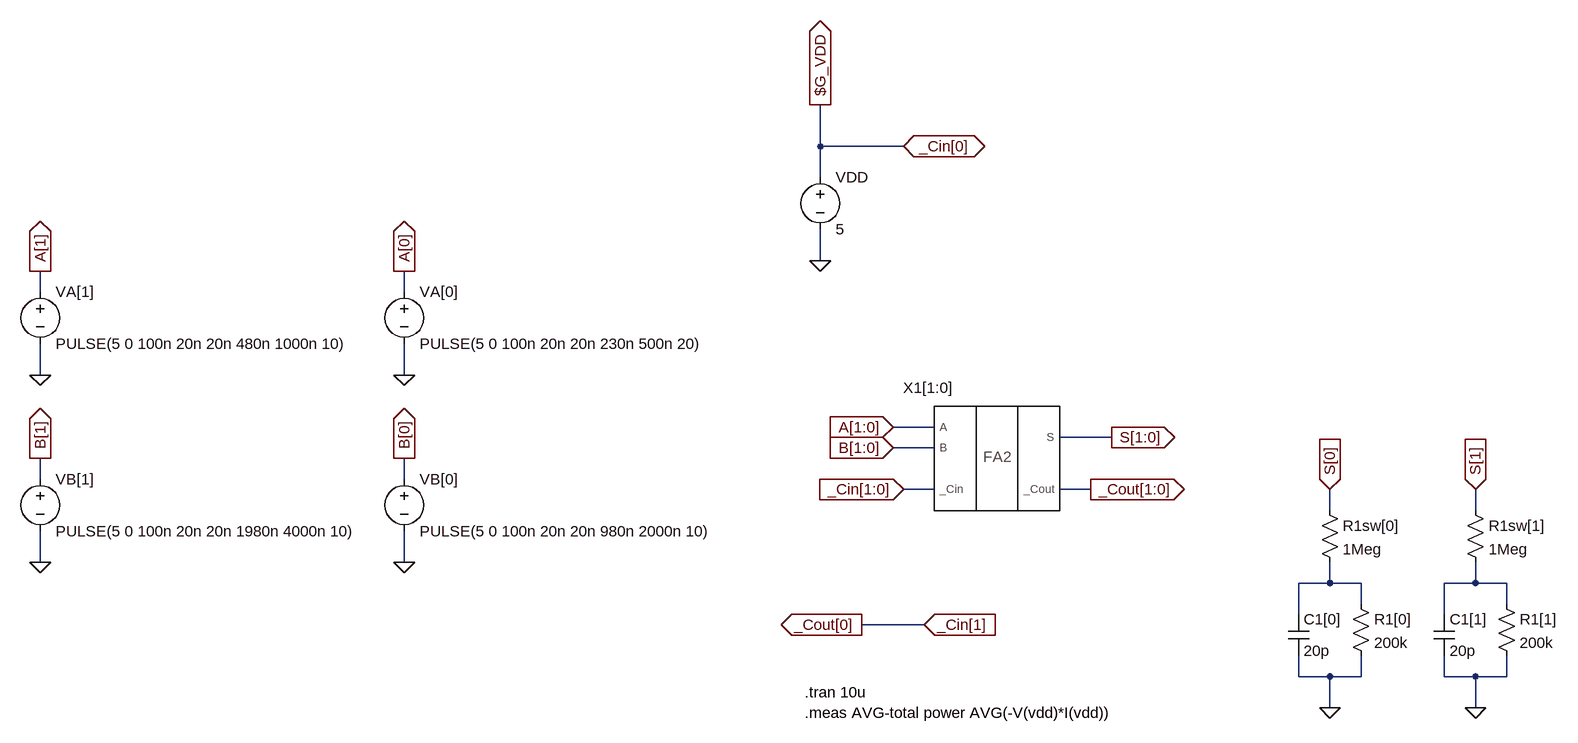
[diagram p0: schematic fa2_top[2bit].asc]
fa2_top[2bit].asc, the LTspice schematic file:
Version 4
SHEET 1 2652 1172
WIRE 0 -80 0 -144
WIRE 128 -80 0 -80
WIRE 0 -32 0 -80
WIRE 0 96 0 48
WIRE -1200 144 -1200 112
WIRE -640 144 -640 112
WIRE -1200 272 -1200 224
WIRE -640 272 -640 224
WIRE 176 352 112 352
WIRE 448 368 368 368
WIRE 176 384 112 384
WIRE -1200 432 -1200 400
WIRE -640 432 -640 400
WIRE 176 448 128 448
WIRE 416 448 368 448
WIRE 784 480 784 448
WIRE 1008 480 1008 448
WIRE -1200 560 -1200 512
WIRE -640 560 -640 512
WIRE 784 592 784 560
WIRE 784 592 736 592
WIRE 832 592 784 592
WIRE 1008 592 1008 560
WIRE 1008 592 960 592
WIRE 1056 592 1008 592
WIRE 832 624 832 592
WIRE 1056 624 1056 592
WIRE 736 640 736 592
WIRE 960 640 960 592
WIRE 160 656 64 656
WIRE 736 736 736 704
WIRE 784 736 736 736
WIRE 832 736 832 704
WIRE 832 736 784 736
WIRE 960 736 960 704
WIRE 1008 736 960 736
WIRE 1056 736 1056 704
WIRE 1056 736 1008 736
WIRE 784 784 784 736
WIRE 1008 784 1008 736
FLAG 0 96 0
FLAG 0 -144 $G_VDD
IOPIN 0 -144 Out
FLAG -640 112 A[0]
IOPIN -640 112 Out
FLAG -640 272 0
FLAG 448 368 S[1:0]
IOPIN 448 368 Out
FLAG 416 448 _Cout[1:0]
IOPIN 416 448 Out
FLAG 128 448 _Cin[1:0]
IOPIN 128 448 In
FLAG 112 352 A[1:0]
IOPIN 112 352 In
FLAG 112 384 B[1:0]
IOPIN 112 384 In
FLAG 128 -80 _Cin[0]
IOPIN 128 -80 BiDir
FLAG 64 656 _Cout[0]
IOPIN 64 656 Out
FLAG 160 656 _Cin[1]
IOPIN 160 656 In
FLAG 784 448 S[0]
IOPIN 784 448 In
FLAG 784 784 0
FLAG 1008 448 S[1]
IOPIN 1008 448 In
FLAG 1008 784 0
FLAG -1200 112 A[1]
IOPIN -1200 112 Out
FLAG -1200 272 0
FLAG -640 400 B[0]
IOPIN -640 400 Out
FLAG -640 560 0
FLAG -1200 400 B[1]
IOPIN -1200 400 Out
FLAG -1200 560 0
SYMBOL voltage 0 -48 R0
WINDOW 123 0 0 Left 2
WINDOW 39 0 0 Left 2
SYMATTR InstName VDD
SYMATTR Value 5
SYMBOL voltage -640 128 R0
WINDOW 123 0 0 Left 2
WINDOW 39 0 0 Left 2
SYMATTR InstName VA[0]
SYMATTR Value PULSE(5 0 100n 20n 20n 230n 500n 20)
SYMBOL fa2 272 400 R0
SYMATTR InstName X1[1:0]
SYMBOL cap 720 640 R0
SYMATTR InstName C1[0]
SYMATTR Value 20p
SYMBOL res 816 608 R0
SYMATTR InstName R1[0]
SYMATTR Value 200k
SYMBOL cap 944 640 R0
SYMATTR InstName C1[1]
SYMATTR Value 20p
SYMBOL res 1040 608 R0
SYMATTR InstName R1[1]
SYMATTR Value 200k
SYMBOL res 768 464 R0
SYMATTR InstName R1sw[0]
SYMATTR Value 1Meg
SYMBOL res 992 464 R0
SYMATTR InstName R1sw[1]
SYMATTR Value 1Meg
SYMBOL voltage -1200 128 R0
WINDOW 123 0 0 Left 2
WINDOW 39 0 0 Left 2
SYMATTR InstName VA[1]
SYMATTR Value PULSE(5 0 100n 20n 20n 480n 1000n 10)
SYMBOL voltage -640 416 R0
WINDOW 123 0 0 Left 2
WINDOW 39 0 0 Left 2
SYMATTR InstName VB[0]
SYMATTR Value PULSE(5 0 100n 20n 20n 980n 2000n 10)
SYMBOL voltage -1200 416 R0
WINDOW 123 0 0 Left 2
WINDOW 39 0 0 Left 2
SYMATTR InstName VB[1]
SYMATTR Value PULSE(5 0 100n 20n 20n 1980n 4000n 10)
TEXT -24 760 Left 2 !.tran 10u\n.meas AVG-total power AVG(-V(vdd)*I(vdd))

The netlist it stands for:
* fa2_top[2bit].asc
VDD _Cin[0] 0 5
VA[0] A[0] 0 PULSE(5 0 100n 20n 20n 230n 500n 20)
XX1[1:0] A[1:0] B[1:0] _Cin[1:0] S[1:0] _Cout[1:0] fa2  ; pins A B _Cin S _Cout
C1[0] N001 0 20p
R1[0] N001 0 200k
C1[1] N002 0 20p
R1[1] N002 0 200k
R1sw[0] S[0] N001 1Meg
R1sw[1] S[1] N002 1Meg
VA[1] A[1] 0 PULSE(5 0 100n 20n 20n 480n 1000n 10)
VB[0] B[0] 0 PULSE(5 0 100n 20n 20n 980n 2000n 10)
VB[1] B[1] 0 PULSE(5 0 100n 20n 20n 1980n 4000n 10)
.tran 10u
.meas AVG-total power AVG(-V(vdd)*I(vdd))
.backanno
.end